# Altium schematic sheet PM.SchDoc
size A4
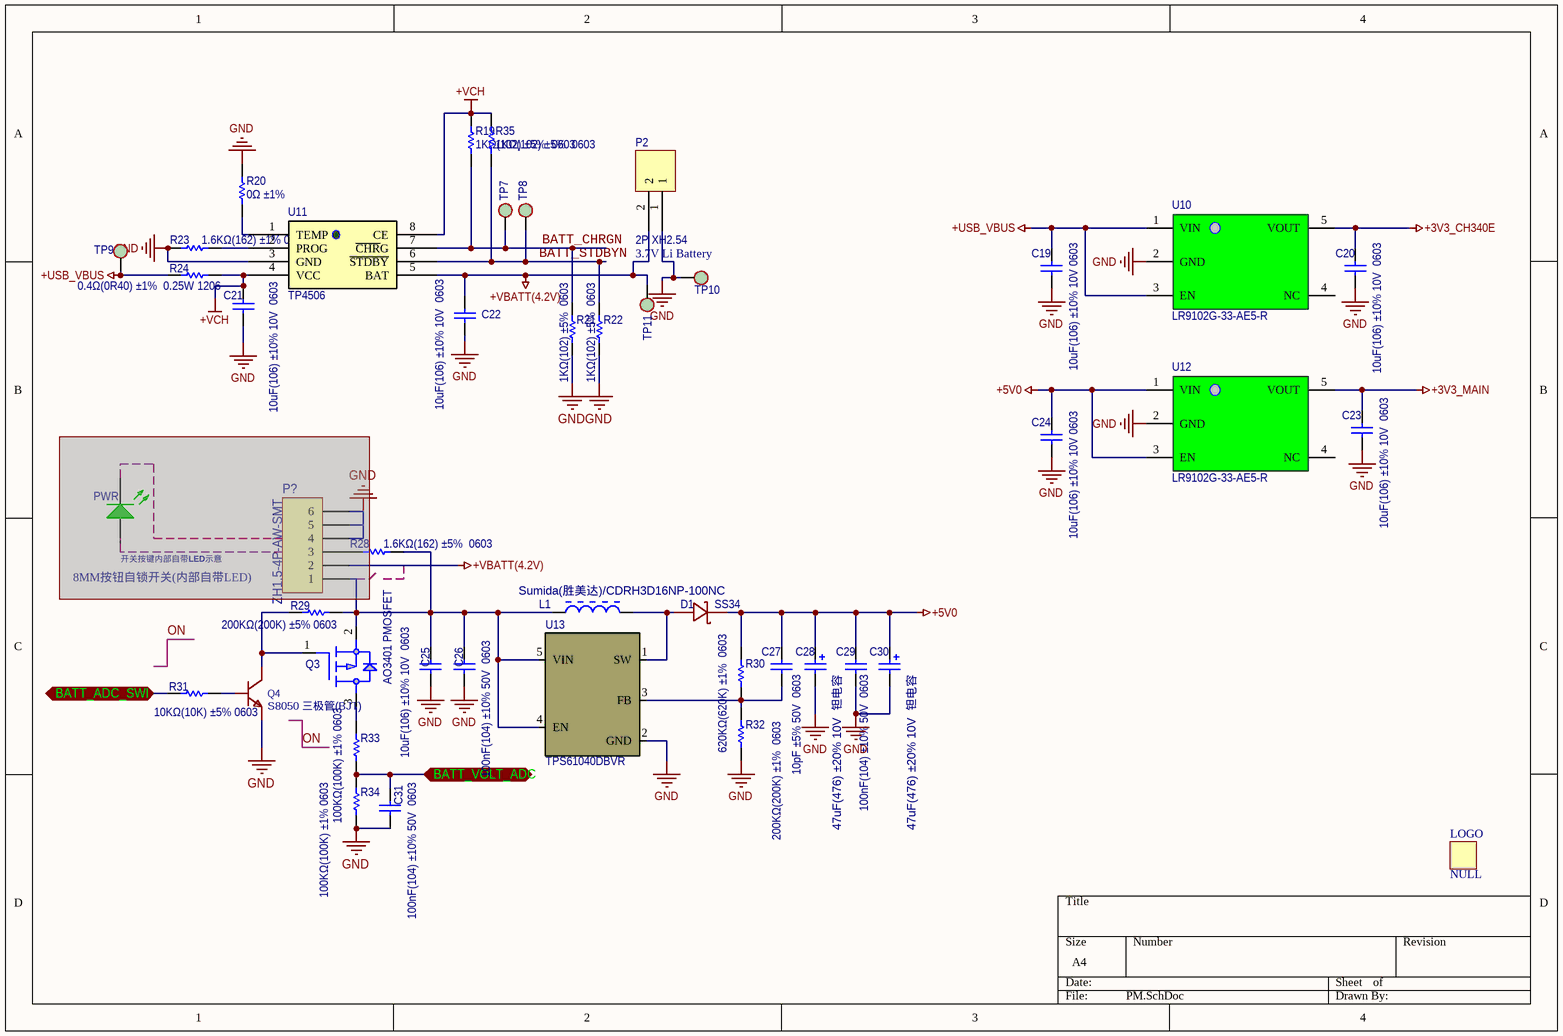
[diagram p0: PM.SchDoc]

## Parts
C19  10uF(106) ±10% 10V 0603  [C0603]
C20  10uF(106) ±10% 10V  0603  [C0603]
C21  10uF(106) ±10% 10V  0603  [C0603]
C22  10uF(106) ±10% 10V  0603  [C0603]
C23  10uF(106) ±10% 10V  0603  [C0603]
C24  10uF(106) ±10% 10V 0603  [C0603]
C25  10uF(106) ±10% 10V  0603  [C0603]
C26  100nF(104) ±10% 50V  0603  [C0603]
C27  10pF ±5% 50V  0603  [C0603]
C28  47uF(476) ±20% 10V  钽电容  [CASE-B_3528]
C29  100nF(104) ±10% 50V  0603  [C0603]
C30  47uF(476) ±20% 10V  钽电容  [CASE-B_3528]
C31  100nF(104) ±10% 50V  0603  [C0603]
D1  SS34  [SMA]
L1  Sumida(胜美达)/CDRH3D16NP-100NC  [L_3.8x3.8x1.8mm]
LED?  注释: PWR  [Through Hole-LED1]  (hidden comment: 翠绿LED, 贴片  发光二极管  0805)  (masked out: inside a compile mask, not in the netlist)
LOGO  NULL  [MYLOGO_BOTTOM]
P2  2P XH2.54  注释: 3.7V Li Battery  [MX1.25-2P]
P?  ZH1.5-4P-AW-SMT  注释: 8MM按钮自锁开关(内部自带LED)  [ZH1.5-6(4P)卧式-SMT]  (masked out: inside a compile mask, not in the netlist)
Q3  AO3401 PMOSFET  [SOT233]
Q4  S8050 三极管(BJT)  [SOT233]
R19  1KΩ(102) ±5%  0603  [R0603]
R20  0Ω ±1%  [R0603]
R21  1KΩ(102) ±5%  0603  [R0603]
R22  1KΩ(102) ±5%  0603  [R0603]
R23  1.6KΩ(162) ±1% 0603  [R0603]
R24  0.4Ω(0R40) ±1%  0.25W 1206  [R1206]
R28  1.6KΩ(162) ±5%  0603  [R0603]
R29  200KΩ(200K) ±5% 0603  [R0603]
R30  620KΩ(620K) ±1%  0603  [R0603]
R31  10KΩ(10K) ±5% 0603  [R0603]
R32  200KΩ(200K) ±1%  0603  [R0603]
R33  100KΩ(100K) ±1% 0603  [R0603]
R34  100KΩ(100K) ±1% 0603  [R0603]
R35  1KΩ(102) ±5%  0603  [R0603]
TP7  NC  [TP]  (value not drawn)
TP8  NC  [TP]  (value not drawn)
TP9  NC  [TP]  (value not drawn)
TP10  NC  [TP]  (value not drawn)
TP11  NC  [TP]  (value not drawn)
U10  LR9102G-33-AE5-R  [SOT-235]
U11  TP4506  [ESOP-8]
U12  LR9102G-33-AE5-R  [SOT-235]
U13  TPS61040DBVR  [SOT-235]

## Ports
BATT_ADC_SWI, BATT_VOLT_ADC

## Nets
+3V3_CH340E: C20.2 U10.5(VOUT)
+3V3_MAIN: C23.2 U12.5(VOUT)
+5V0: C24.2 C27.1 C28.1 C29.1 C30.1 D1.1(C) R30.1 U12.1(VIN) U12.3(EN)
+USB_VBUS: C19.2 R24.2 TP9.1 U10.1(VIN) U10.3(EN)
+VBATT(4.2V): C22.2 P2.2 TP11.1 U11.5(BAT)
+VCH: C21.2 R19.1 R24.1 R35.1 U11.4(VCC) U11.8(CE)
GND: C19.1 C20.1 C21.1 C22.1 C23.1 C24.1 C25.2 C26.2 C28.2 C29.2 C30.2 C31.1 P2.1 Q4.2(E) R20.1 R21.2 R22.2 R23.2 R32.2 R34.2 TP10.1 U10.2(GND) U11.3(GND) U12.2(GND) U13.2(GND)
BATT_ADC_SWI: R31.2 ; port BATT_ADC_SWI
BATT_CHRGN: R19.2 R21.1 TP7.1 U11.7(~{CHR}G)
BATT_STDBYN: R22.1 R35.2 TP8.1 U11.6(~{STDBY})
BATT_VOLT_ADC: C31.2 R33.2 R34.1 ; port BATT_VOLT_ADC
NetC25_1: C25.1 C26.1 L1.1 Q3.2(SOURCE) R28.1 R29.1 U13.4(EN) U13.5(VIN)
NetC27_2: C27.2 R30.2 R32.1 U13.3(FB)
NetD1_2: D1.2(A) L1.2 U13.1(SW)
NetQ3_1: Q3.1(GATE) Q4.3(C) R29.2
NetQ3_3: Q3.3(DRAIN) R33.1
NetQ4_1: Q4.1(B) R31.1
NetR20_2: R20.2 U11.1(TEMP)
NetR23_1: R23.1 U11.2(PROG)

Not connected (* = marked no-connect by the designer): R28 2; U10 4(NC); U12 4(NC)

## Notes on the sheet
- (near LED?) 开关按键内部自带LED示意
- ON

## Library data of the parts
C19-C27 C29 C31 = Cap: 0603贴片电容; Published: 8-Jun-2000; LatestRevisionDate: 17-Jul-2002; LatestRevisionNote: Re-released for DXP Platform.; PackageReference: RAD-0.3; Publisher: Altium Limited; PackageDescription: Radial Cap, Thru-Hole; 2 Leads; 0.3 in Pin Spacing
C28 C30 = Cap Pol2: CASE_B 3528钽电容; Published: 8-Jun-2000; LatestRevisionDate: 17-Jul-2002; LatestRevisionNote: Re-released for DXP Platform.; PackageReference: POLAR0.8; Publisher: Altium Limited; PackageDescription: Polarized Capacitor; 2 Leads
D1 = PMEG3005EB,115: Shottky 二极管; BOM_Manufacturer: Nexperia; Contributor: LCSC; BOM_Supplier: LCSC; BOM_Supplier Part: C455040; BOM_Manufacturer Part: PMEG3005EB,115; spicePre: D; spiceSymbolName: PMEG3005EB,115
L1 = CMP-0686-00187-3: Chip Ferrite Bead for General Use, 600 Ohm, 300 mA, -55 to 125 degC, 1 x 0.5 x 0.55 mm SMD, Tape and Reel; Manufacturer: Murata; PartNumber: BLM15AG601SN1D; Impedance (at 100 MHz): 600 Ohm +/- 25%; DC Resistance: 0.52 Ohm Max.; Rated Current: 300 mA; PackageDescription: 2-Pin Chip, Body 1 x 0.5 mm; Mounting Technology: Surface Mount; ComponentLink1Description: Manufacturer URL; ComponentLink3Description: Package Specification; ComponentLink2Description: Datasheet; Operating Temperature Range: -55 to 125 degC; Packing: Tape and Reel; ComponentLink1URL: http://www.murata.com/; PackageReference: BLM15-2; DatasheetVersion: 08/2013; ComponentLink3URL: http://www.murata.com/products/catalog/pdf/c31e.pdf; ComponentLink2URL: http://www.murata.com/products/catalog/pdf/c31e.pdf; Value: Sumida(胜美达)/CDRH3D16NP-100NC
LED? = LTST-C190KGKT: LED GREEN CLEAR 0603 SMD; Manufacturer: Lite-On Inc.; Manufacturer part #: LTST-C190KGKT; Creation date: 04-Jul-2017; Created by: eteofilo; Modified by: *; Indications: *; Value: *
LOGO = MYLOGO_BOTTOM: LOGO
P2 = Header 2x1 0.05'' PTH: XH2.54-2P座子; Manufacturer: Sullins Connector Solutions; Manufacturer Part #: GRPB021VWVN-RC; Created By: Jose; Creation Date: 7-Sept-2017; Modified by: *; Indications: *
P? = Header 6: Header, 6-Pin; LatestRevisionDate: 17-Jul-2002; LatestRevisionNote: Re-released for DXP Platform.; Publisher: Altium Limited
Q3 = MOSFET_P_0: P沟道 MOSFET
Q4 = S8050_C908252: NPN 三极管(BJT); BOM_Manufacturer: FUXINSEMI; Contributor: LCSC; BOM_Supplier: LCSC; BOM_Supplier Part: C908252; BOM_Manufacturer Part: S8050; BOM_JLCPCB Part Class: Extended Part; spicePre: Q; spiceSymbolName: S8050_C908252
R19-R23 R28-R35 = Res1: 0603贴片电阻; Published: 8-Jun-2000; LatestRevisionDate: 17-Jul-2002; LatestRevisionNote: Re-released for DXP Platform.; PackageReference: AXIAL-0.3; Publisher: Altium Limited; PackageDescription: Axial Device, Thru-Hole; 2 Leads; 0.3 in Pin Spacing
R24 = Res1: 1206贴片电阻; Published: 8-Jun-2000; LatestRevisionDate: 17-Jul-2002; LatestRevisionNote: Re-released for DXP Platform.; PackageReference: AXIAL-0.3; Publisher: Altium Limited; PackageDescription: Axial Device, Thru-Hole; 2 Leads; 0.3 in Pin Spacing
TP7-TP11 = TP: 测试点
U10 U12 = LR9102G-33-AE5-R: 线性稳压器(LDO)
U11 = TP4056: 锂电池充电管理IC
U13 = TPS61040 /Boost: DCDC电源IC